# EAGLE design AeroQuadTiny_v100 (EAGLE 5.10)
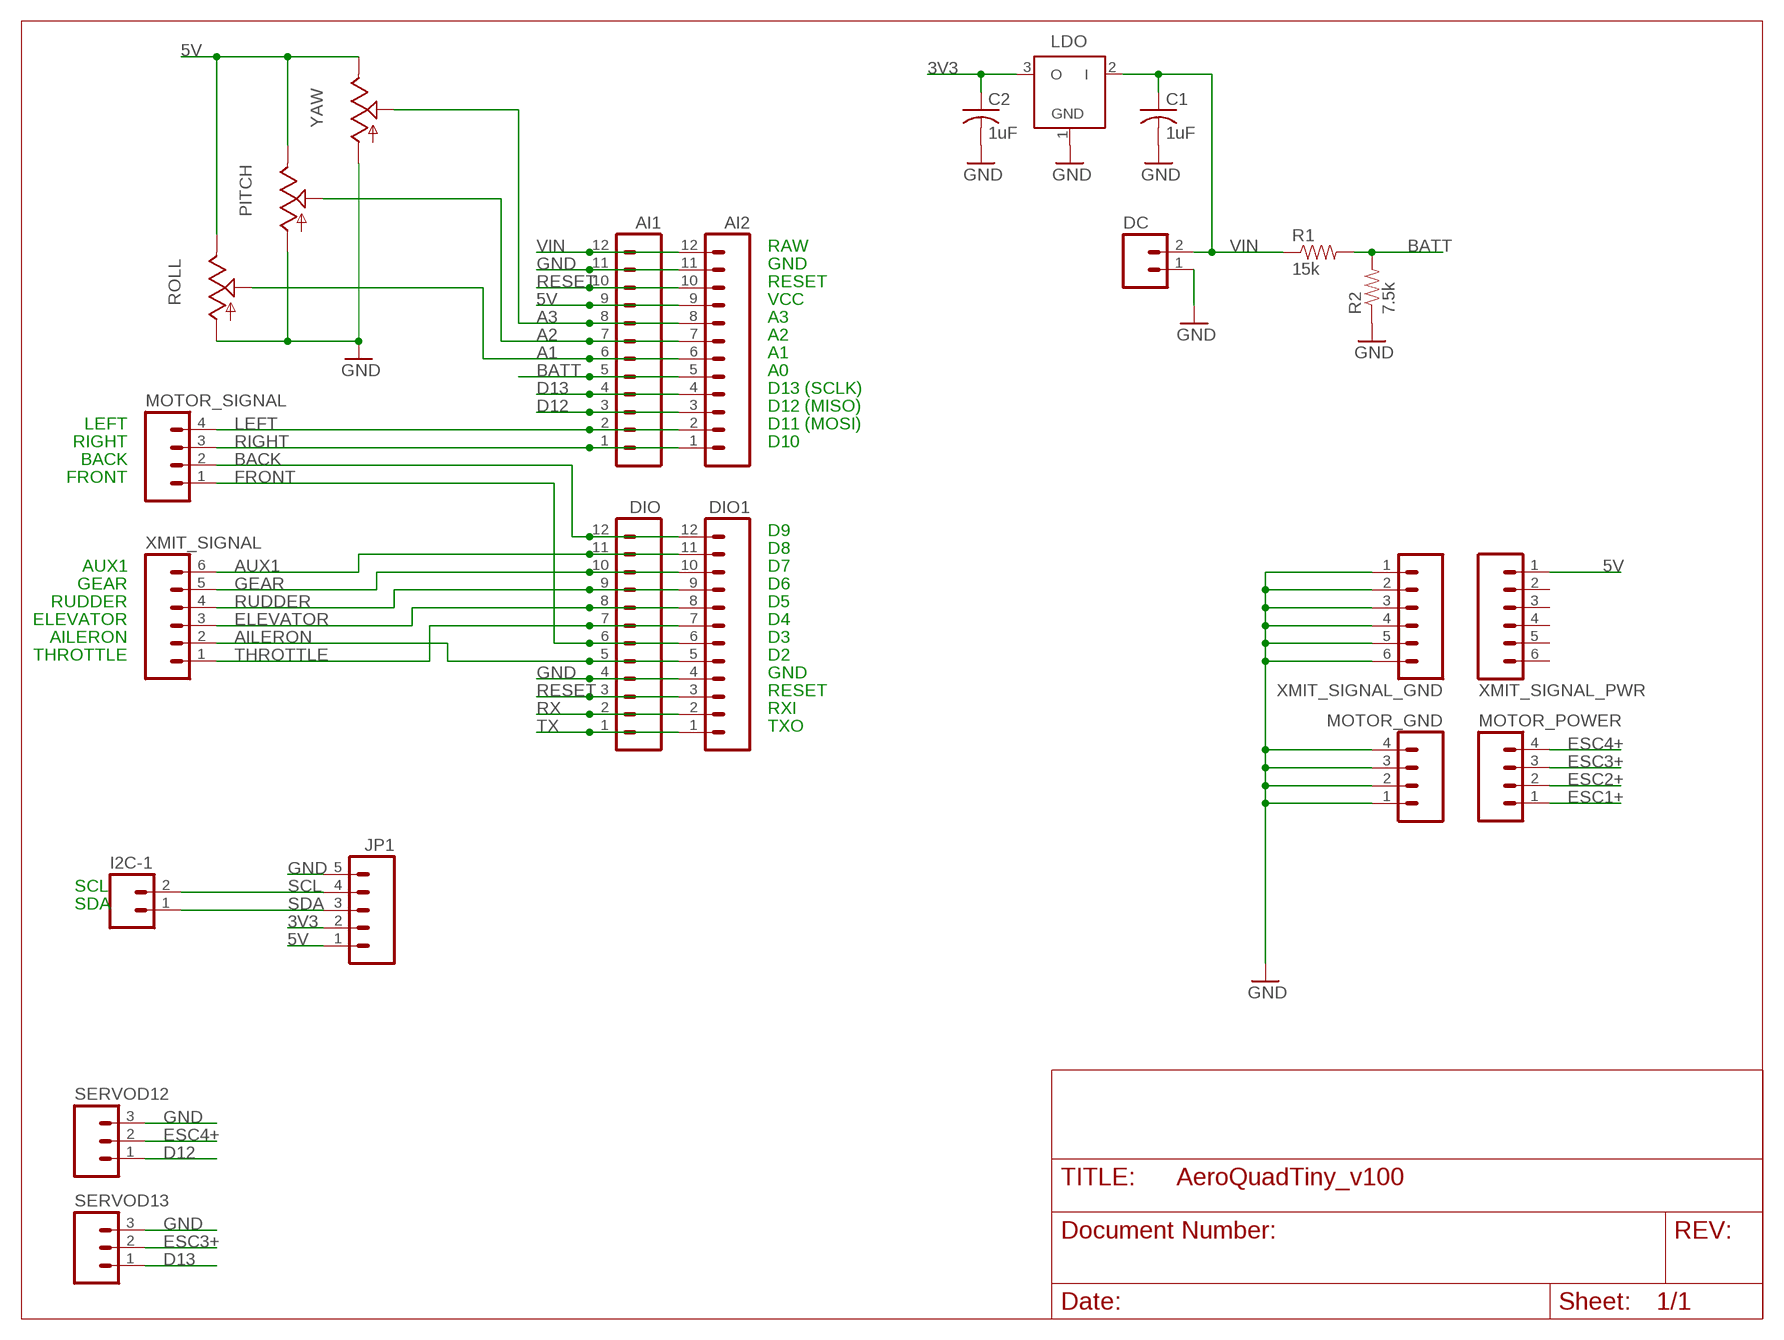
[diagram p0: schematic, sheet 1]

## Parts
AI1  M12LOCK  [1X12_LOCK]
AI2  M12LOCK  [1X12_LOCK]
C1  1uF  C-US050-024X044  [C050-024X044]
C2  1uF  C-US050-024X044  [C050-024X044]
DC  M02LOCK  [1X02_LOCK]
DIO  M12LOCK  [1X12_LOCK]
DIO1  M12LOCK  [1X12_LOCK]
I2C-1  M02LOCK  [1X02_LOCK]
JP1  M05LOCK  [1X05_LOCK]
LDO  MCP1702-33  MCP1702Z  [TO92]
MOTOR_GND  M04LOCK  [1X04_LOCK]
MOTOR_POWER  M04LOCK  [1X04_LOCK]
MOTOR_SIGNAL  M04LOCK  [1X04_LOCK]
PITCH  TRIM_US-CA6H  [CA6H]
R1  15k  RESISTORPTH-1/6W  [1/6W-RES]
R2  7.5k  RESISTORPTH-1/6W  [1/6W-RES]
ROLL  TRIM_US-CA6H  [CA6H]
SERVOD12  M03LOCK  [1X03_LOCK]
SERVOD13  M03LOCK  [1X03_LOCK]
XMIT_SIGNAL  M06LOCK  [1X06_LOCK]
XMIT_SIGNAL_GND  M06LOCK  [1X06_LOCK]
XMIT_SIGNAL_PWR  M06LOCK  [1X06_LOCK]
YAW  TRIM_US-CA6H  [CA6H]

## Nets
3V3: C2.1 JP1.2 LDO.3(O)
5V: AI1.9 AI2.9 JP1.1 PITCH.E ROLL.E XMIT_SIGNAL_PWR.1 YAW.E
A1: AI1.6 AI2.6 ROLL.S
A2: AI1.7 AI2.7 PITCH.S
A3: AI1.8 AI2.8 YAW.S
AILERON: DIO1.5 DIO.5 XMIT_SIGNAL.2
AUX1: DIO1.11 DIO.11 XMIT_SIGNAL.6
BACK: DIO1.12 DIO.12 MOTOR_SIGNAL.2
BATT: AI1.5 AI2.5 R1.2 R2.2
D12: AI1.3 AI2.3 SERVOD12.1
D13: AI1.4 AI2.4 SERVOD13.1
ELEVATOR: DIO1.8 DIO.8 XMIT_SIGNAL.3
ESC1+: MOTOR_POWER.1
ESC2+: MOTOR_POWER.2
ESC3+: MOTOR_POWER.3 SERVOD13.2
ESC4+: MOTOR_POWER.4 SERVOD12.2
FRONT: DIO1.6 DIO.6 MOTOR_SIGNAL.1
GEAR: DIO1.10 DIO.10 XMIT_SIGNAL.5
GND: AI1.11 AI2.11 C1.2 C2.2 DC.1 DIO1.4 DIO.4 JP1.5 LDO.1(GND) MOTOR_GND.1 MOTOR_GND.2 MOTOR_GND.3 MOTOR_GND.4 PITCH.A R2.1 ROLL.A SERVOD12.3 SERVOD13.3 XMIT_SIGNAL_GND.1 XMIT_SIGNAL_GND.2 XMIT_SIGNAL_GND.3 XMIT_SIGNAL_GND.4 XMIT_SIGNAL_GND.5 XMIT_SIGNAL_GND.6 YAW.A
LEFT: AI1.2 AI2.2 MOTOR_SIGNAL.4
RESET: AI1.10 AI2.10 DIO1.3 DIO.3
RIGHT: AI1.1 AI2.1 MOTOR_SIGNAL.3
RUDDER: DIO1.9 DIO.9 XMIT_SIGNAL.4
RX: DIO1.2 DIO.2
SCL: I2C-1.2 JP1.4
SDA: I2C-1.1 JP1.3
THROTTLE: DIO1.7 DIO.7 XMIT_SIGNAL.1
TX: DIO1.1 DIO.1
VIN: AI1.12 AI2.12 C1.1 DC.2 LDO.2(I) R1.1
Unconnected: XMIT_SIGNAL_PWR.2 XMIT_SIGNAL_PWR.3 XMIT_SIGNAL_PWR.4 XMIT_SIGNAL_PWR.5 XMIT_SIGNAL_PWR.6

## Notes on the sheet
- RAW
- GND
- RESET
- VCC
- A3
- A2
- A1
- A0
- D13 (SCLK)
- D12 (MISO)
- LEFT | D11 (MOSI)
- RIGHT | D10
- BACK
- FRONT
- D9
- D8
- AUX1 | D7
- GEAR | D6
- RUDDER | D5
- ELEVATOR | D4
- AILERON | D3
- THROTTLE | D2
- GND
- RESET
- RXI
- TXO
- SCL
- SDA

## Library data of the parts
AI1 AI2 DIO DIO1 = SparkFun:M12: Header 12 Standard 12-pin 0.1" header. Use with straight break away headers (SKU : PRT-00116), right angle break away headers (PRT-00553), swiss pins (PRT-00743), machine pins (PRT-00117), and female headers (PRT-00115).
C1 C2 = rcl:C-US: CAPACITOR, American symbol
DC I2C-1 = SparkFun:M02: Header 2 Standard 2-pin 0.1" header. Use with straight break away headers (SKU : PRT-00116), right angle break away headers (PRT-00553), swiss pins (PRT-00743), machine pins (PRT-00117), and female headers (PRT-00115). Molex polarized connector foot print use with SKU : PRT-08233 with associated crimp pins and housings.
JP1 = SparkFun:M05: Header 5 Standard 5-pin 0.1" header. Use with straight break away headers (SKU : PRT-00116), right angle break away headers (PRT-00553), swiss pins (PRT-00743), machine pins (PRT-00117), and female headers (PRT-00115). Molex polarized connector foot print use with SKU : PRT-08230 with associated crimp pins and housings.
LDO = JeeLabs:MCP1702: 200 mA, Low Power Low Dropout Voltage Regulator
MOTOR_GND MOTOR_POWER MOTOR_SIGNAL = SparkFun:M04: Header 4 Standard 4-pin 0.1" header. Use with straight break away headers (SKU : PRT-00116), right angle break away headers (PRT-00553), swiss pins (PRT-00743), machine pins (PRT-00117), and female headers (PRT-00115). Molex polarized connector foot print use with SKU : PRT-08231 with associated crimp pins and housings.
PITCH ROLL YAW = pot:TRIM_US-: POTENTIOMETER
R1 R2 = SparkFun:RESISTOR: Resistor Basic schematic elements and footprints for 0603, 1206, and PTH 1/10th watt (small) resistors.
SERVOD12 SERVOD13 = SparkFun:M03: Header 3 Standard 3-pin 0.1" header. Use with straight break away headers (SKU : PRT-00116), right angle break away headers (PRT-00553), swiss pins (PRT-00743), machine pins (PRT-00117), and female headers (PRT-00115). Molex polarized connector foot print use with SKU : PRT-08232 with associated crimp pins and housings.
XMIT_SIGNAL XMIT_SIGNAL_GND XMIT_SIGNAL_PWR = SparkFun:M06: Header 6 Standard 6-pin 0.1" header. Use with straight break away headers (SKU : PRT-00116), right angle break away headers (PRT-00553), swiss pins (PRT-00743), machine pins (PRT-00117), and female headers (PRT-00115). Molex polarized connector foot print use with SKU : PRT-08094 with associated crimp pins and housings. NOTES ON THE VARIANTS LOCK and LOCK_LONGPADS... This footprint was designed to help hold the alignment of a through-hole component (i.e. 6-pin header) while soldering it into place. You may notice that each hole has been shifted either up or down by 0.005 of an inch from it's more standard position (which is a perfectly straight line). This slight alteration caused the pins (the squares in the middle) to touch the edges of the holes. Because they are alternating, it causes a "brace" to hold the component in place. 0.005 has proven to be the perfect amount of "off-center" position when using our standard breakaway headers. Although looks a little odd when you look at the bare footprint, once you have a header in there, the alteration is very hard to notice. Also, if you push a header all the way into place, it is covered up entirely on the bottom side. This idea of altering the position of holes to aid alignment will be further integrated into the Sparkfun Library for other footprints. It can help hold any component with 3 or more connection pins.

## Board
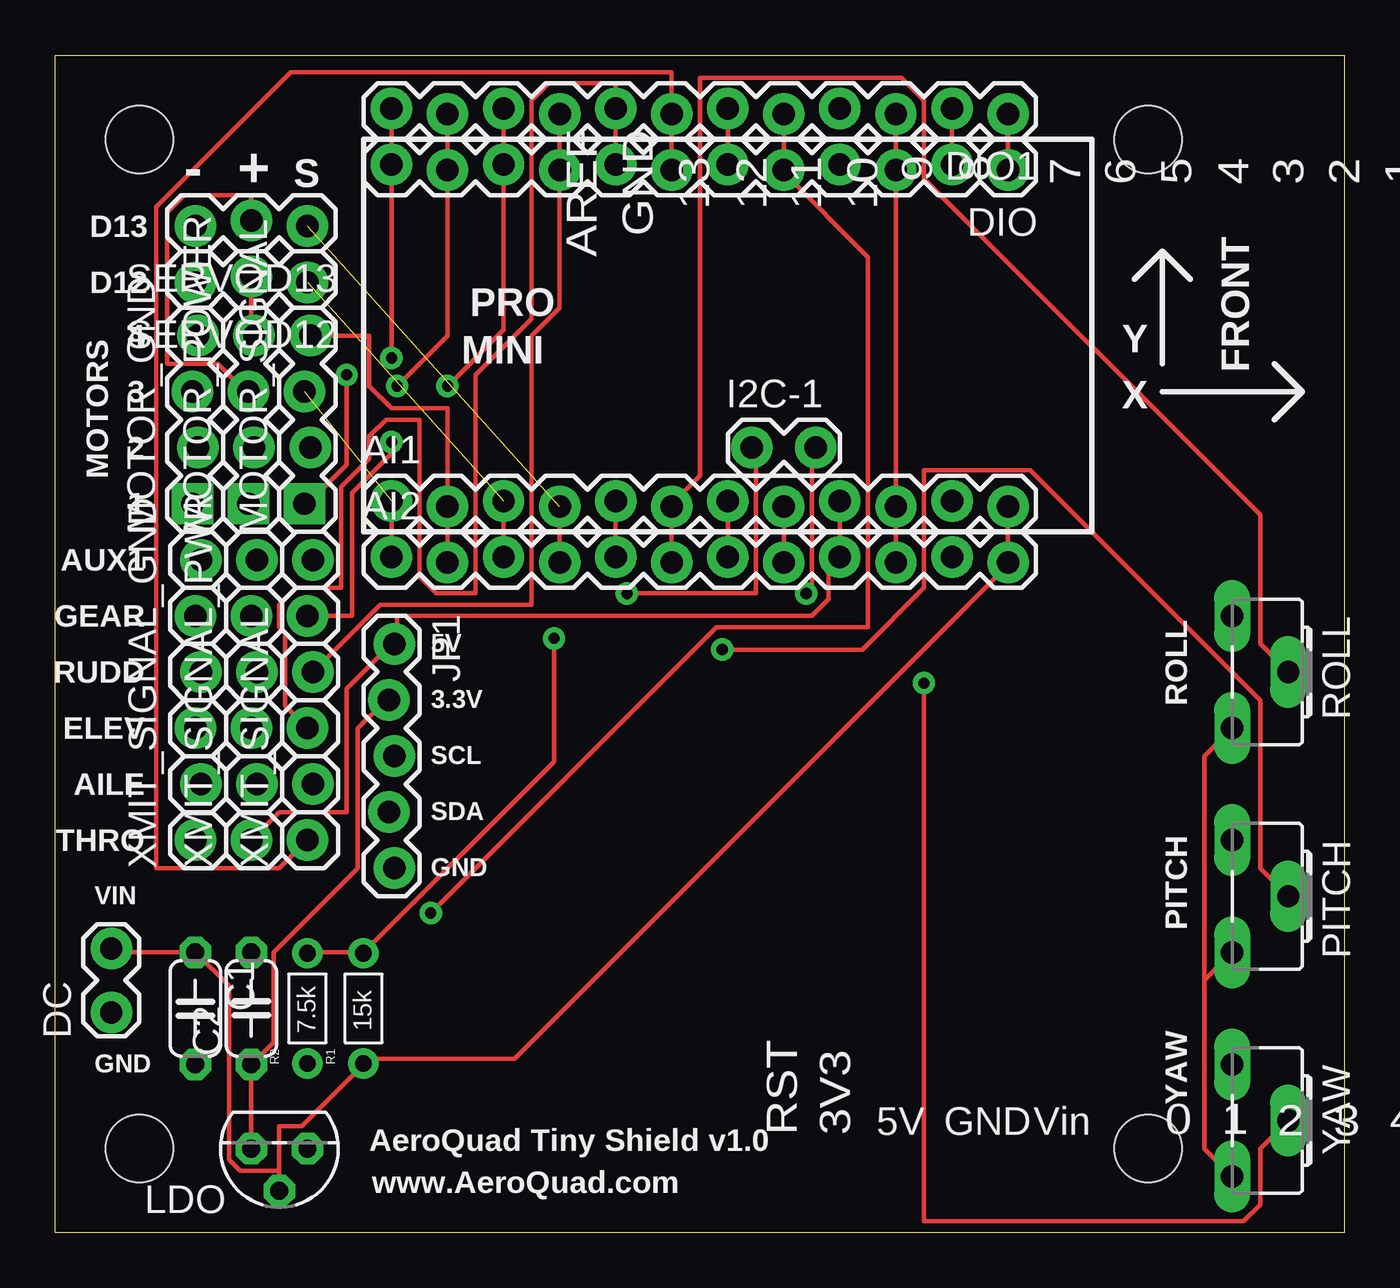
[diagram p1: board, top side]
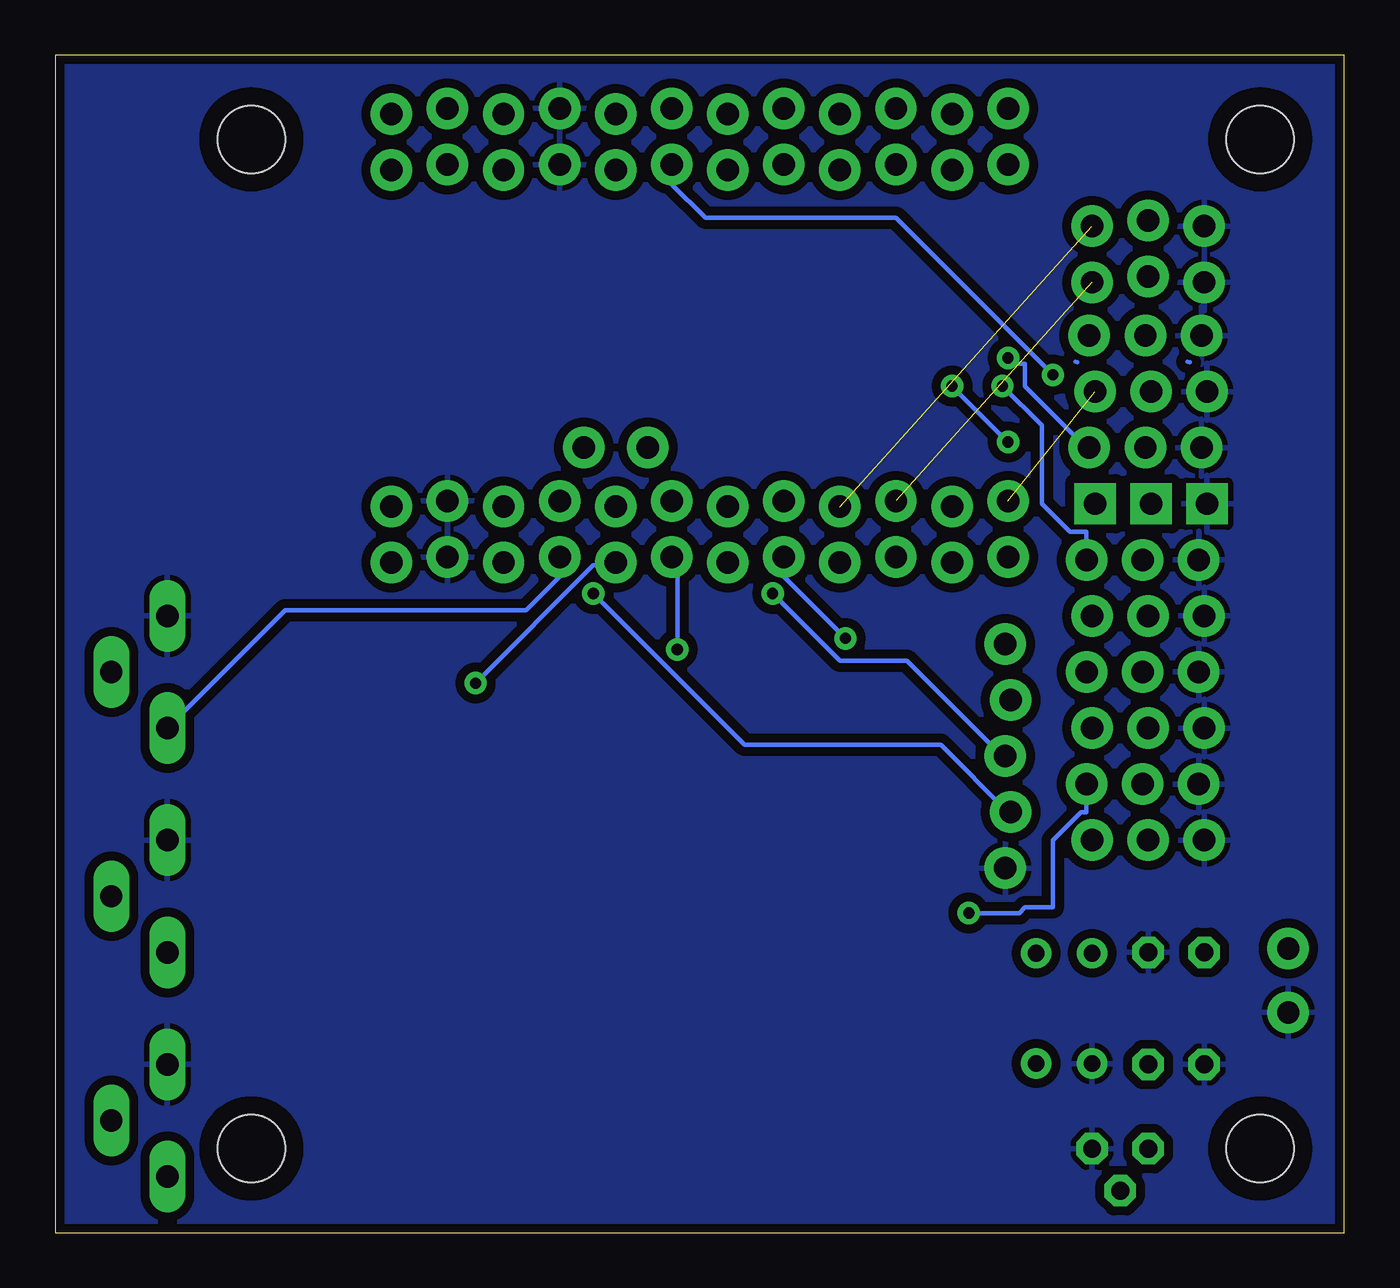
[diagram p2: board, bottom side, seen from below]

Size 58.42 x 53.34 mm. Coordinates in mm from the lower left corner, seen from the top.
Outline: 0,53.34 58.42,53.34 58.42,0 0,0 0,53.34
Copper layers (1*16): Top 0.035mm / dielectric 1.5mm / Bottom 0.035mm
Design rules "SparkFun": minimum track width 8mil, minimum drill 20mil, track to track 8mil, track to pad 8mil, pad to pad 8mil, via to via 8mil, smd to smd 8mil, copper to edge 10mil, drill to drill 8mil, minimum pad ring 12mil, minimum via ring 10mil, stop-mask expansion 4mil, vias tented up to drill 25mil, thermal gap 10mil

### Footprints (pad centres in the part's own frame; a part is rotated, then mirrored left to right if it is on the bottom)
1X12_LOCK = drill 1.016 pad 1.88 round: 1 0,0.127; 2 2.54,-0.127; 3 5.08,0.127; 4 7.62,-0.127; 5 10.16,0.127; 6 12.7,-0.127; 7 15.24,0.127; 8 17.78,-0.127; 9 20.32,0.127; 10 22.86,-0.127; 11 25.4,0.127; 12 27.94,-0.127
C050-024X044 = drill 0.813 octagon: 1 -2.54,0; 2 2.54,0
1X02_LOCK = drill 1.016 pad 1.88 round: 1 -0.178,0; 2 2.718,0
1X05_LOCK = drill 1.016 pad 1.88 round: 1 0,0.127; 2 2.54,-0.127; 3 5.08,0.127; 4 7.62,-0.127; 5 10.16,0.127
TO92 = drill 0.813 octagon: 1 -1.27,0; 2 0,1.905; 3 1.27,0
1X04_LOCK = drill 1.016 pad 1.88 square: 1 0,0.127 | drill 1.016 pad 1.88 round: 2 2.54,-0.127; 3 5.08,0.127; 4 7.62,-0.127
CA6H = drill 1.016 long: A -2.54,0; E 2.54,0; S 0,2.54
1/6W-RES = drill 0.762 round: 1 -2.5,0; 2 2.5,0
1X03_LOCK = drill 1.016 pad 1.88 round: 1 0,0.127; 2 2.54,-0.127; 3 5.08,0.127
STAND-OFF-TIGHT = hole 3.048: 0,0
1X06_LOCK = drill 1.016 pad 1.88 round: 1 0,0; 2 2.54,-0.254; 3 5.08,0; 4 7.62,-0.254; 5 10.16,0; 6 12.7,-0.254

### Placement (x,y rotation side)
AI1  15.24,33.02 0 top
AI2  15.24,30.48 0 top
C1  6.35,10.16 270 top
C2  8.89,10.16 90 top
DC  2.54,10.16 90 top
DIO  43.18,48.26 180 top
DIO1  43.18,50.8 180 top
I2C-1  31.75,35.56 0 top
JP1  15.24,26.67 270 top
LDO  10.16,3.81 180 top
MOTOR_GND  6.35,33.02 90 top
MOTOR_POWER  8.89,33.02 90 top
MOTOR_SIGNAL  11.43,33.02 90 top
PITCH  53.34,15.24 270 top
R1  13.97,10.16 90 top
R2  11.43,10.16 90 top
ROLL  53.34,25.4 270 top
SERVOD12  11.43,43.18 180 top
SERVOD13  11.43,45.72 180 top
U$1  [STAND-OFF-TIGHT]  3.81,3.81 0 top
U$3  [STAND-OFF-TIGHT]  49.53,49.53 0 top
U$4  [STAND-OFF-TIGHT]  49.53,3.81 0 bottom
U$5  [STAND-OFF-TIGHT]  3.81,49.53 0 top
XMIT_SIGNAL  11.43,17.78 90 top
XMIT_SIGNAL_GND  6.35,17.78 90 top
XMIT_SIGNAL_PWR  8.89,17.78 90 top
YAW  53.34,5.08 270 top

### Tracks (layer width: path | path; a pad name or v marks a point on that pad's centre or on a via)
3V3
  Top 0.203: LDO.3 C2.1 9.91,8.64 9.91,12.7 13.72,16.51 13.72,22.86 14.99,24.13 JP1.2
5V
  Top 0.203: YAW.E 52.07,3.81 52.07,11.43 | 52.07,11.43 PITCH.E | ROLL.E 52.07,21.59 52.07,11.43 | AI1.9 AI2.9 35.56,30.48 35.05,29.97 35.05,28.7 34.29,27.94 15.49,27.94 15.49,26.67 JP1.1 15.24,26.67 13.21,24.64 13.21,19.05 10.16,19.05 XMIT_SIGNAL_PWR.1
  Bottom 0.203: ROLL.E 48.01,28.19 37.08,28.19 35.56,29.72 AI2.9
A1
  Top 0.203: ROLL.S 54.61,26.67 54.61,32.51 39.37,47.75 39.37,51.31 38.35,52.32 29.21,52.32 29.21,34.29 27.94,33.02 AI1.6 AI2.6
A2  (via drill 0.51)
  Top 0.203: PITCH.S 54.61,16.51 54.61,24.13 44.2,34.54 39.37,34.54 39.37,29.21 36.58,26.42 v30.23,26.42 | AI2.7 AI1.7
  Bottom 0.203: v30.23,26.42 30.23,30.48 30.48,30.48 AI2.7
A3  (via drill 0.51)
  Top 0.203: YAW.S 54.61,3.81 54.61,1.27 53.85,0.51 39.37,0.51 v39.37,24.89 | AI2.8 AI1.8
  Bottom 0.203: v39.37,24.89 34.04,30.23 33.02,30.23 AI2.8
AILERON  (via drill 0.51)
  Top 0.203: v17.02,14.48 29.97,27.43 36.83,27.43 36.83,44.2 33.02,48.01 DIO.5 DIO1.5
  Bottom 0.203: XMIT_SIGNAL.2 11.68,19.05 11.94,19.05 13.21,17.78 13.21,14.73 14.48,14.73 14.73,14.48 v17.02,14.48
AUX1  (via drill 0.51)
  Top 0.203: v15.49,38.35 17.78,40.64 DIO.11 DIO1.11
  Bottom 0.203: XMIT_SIGNAL.6 11.68,31.75 12.45,31.75 13.72,33.02 13.72,36.58 v15.49,38.35
BACK  (via drill 0.51)
  Top 0.203: v15.24,39.62 DIO.12 DIO1.12
  Bottom 0.203: v15.24,39.62 14.99,39.37 14.48,39.37 14.48,38.35 11.68,35.56 MOTOR_SIGNAL.2
BATT  (via drill 0.51)
  Top 0.203: 13.97,12.7 11.43,12.7 R2.2 | 13.97,12.7 22.61,21.34 v22.61,26.92 | 13.97,12.7 R1.2 | AI2.5 AI1.5
  Bottom 0.203: v22.61,26.92 25.4,29.72 AI2.5
D12  (1 unrouted)
  Top 0.203: AI2.3 AI1.3
D13  (1 unrouted)
  Top 0.203: AI2.4 AI1.4
ELEVATOR
  Top 0.203: XMIT_SIGNAL.3 10.41,23.88 10.41,27.18 10.16,27.43 10.16,28.45 10.92,29.21 12.95,29.21 12.95,33.78 14.22,35.05 14.22,36.07 14.99,36.83 16.51,36.83 16.51,29.72 17.27,28.96 19.05,28.96 19.05,38.86 21.59,41.4 21.59,51.31 22.35,52.07 25.4,52.07 DIO1.8 DIO.8
ESC3+
  Top 0.203: MOTOR_POWER.3 8.64,38.1 7.37,39.37 5.08,39.37 5.08,46.23 5.84,46.99 8.89,46.99 SERVOD13.2
ESC4+
  Top 0.203: MOTOR_POWER.4 8.89,40.64 SERVOD12.2
FRONT  (via drill 0.51)
  Top 0.203: v13.21,38.86 13.21,34.8 11.43,33.02 MOTOR_SIGNAL.1 | DIO.6 DIO1.6
  Bottom 0.203: v13.21,38.86 20.32,45.97 28.96,45.97 30.48,47.5 DIO.6
GEAR  (via drill 0.51)
  Top 0.203: XMIT_SIGNAL.5 13.46,27.94 13.46,33.53 15.24,35.31 v15.24,35.81 | v17.78,38.35 20.32,40.89 DIO.10 DIO1.10
  Bottom 0.203: v15.24,35.81 v17.78,38.35
GND
  pour Bottom (isolate 0.406): 0,53.34 58.42,53.34 58.42,0 0,0
LEFT
  Top 0.203: AI2.2 AI1.2 17.78,37.34 15.24,37.34 14.22,38.35 14.22,40.64 MOTOR_SIGNAL.4
N$7
  Bottom 0.203: 12.09,39.42 12.19,39.45
N$10
  Bottom 0.203: 7.01,39.42 7.11,39.45
RESET
  Top 0.203: AI2.10 AI1.10 DIO.3 DIO1.3
RIGHT  (1 unrouted)
  Top 0.203: AI2.1 AI1.1
RUDDER
  Top 0.203: XMIT_SIGNAL.4 14.73,28.45 21.59,28.45 21.59,40.64 22.86,41.91 DIO.9 DIO1.9
RX
  Top 0.203: DIO.2 DIO1.2
SCL  (via drill 0.51)
  Top 0.203: v34.04,28.96 34.29,29.21 34.29,35.56 I2C-1.2
  Bottom 0.203: v34.04,28.96 27.18,22.1 18.29,22.1 15.24,19.05 JP1.4
SDA  (via drill 0.51)
  Top 0.203: v25.91,28.96 31.75,28.96 31.75,35.56 I2C-1.1
  Bottom 0.203: v25.91,28.96 22.86,25.91 19.81,25.91 15.49,21.59 JP1.3
THROTTLE
  Top 0.203: XMIT_SIGNAL.1 10.16,16.51 4.57,16.51 4.57,46.48 10.67,52.58 27.94,52.58 DIO1.7 DIO.7
TX
  Top 0.203: DIO.1 DIO1.1
VIN
  Top 0.203: DC.2 2.54,12.7 C1.1 7.87,11.18 7.87,3.3 8.38,2.79 10.16,2.79 | AI1.12 AI2.12 43.18,30.23 20.83,7.87 13.97,7.87 R1.1 13.97,7.62 11.18,4.83 10.16,4.83 10.16,2.79 | LDO.2 10.16,2.79

### Text on the board
tPlace: - | + | S | D13 | D12 | PRO | 4 | Y | 3 | MINI | X | FRONT | 2 | MOTORS | 1 | AUX1 | GEAR | RUDD | 5V | 3.3V | ROLL | ELEV | AILE | SCL | SDA | THRO | GND | VIN | PITCH | YAW | GND | AeroQuad Tiny Shield v1.0 | www.AeroQuad.com
tNames: 9 | 8 | 7 | 6 | 5 | 4 | 3 | 2 | 1 | 0 | 13 | 12 | 11 | 10 | GND | AREF | RST | 3V3 | 5V | GND | Vin | 0 | 1 | 2 | 3 | 4 | 5